# EAGLE design MMA7660FCv1.0 (EAGLE 5.10)
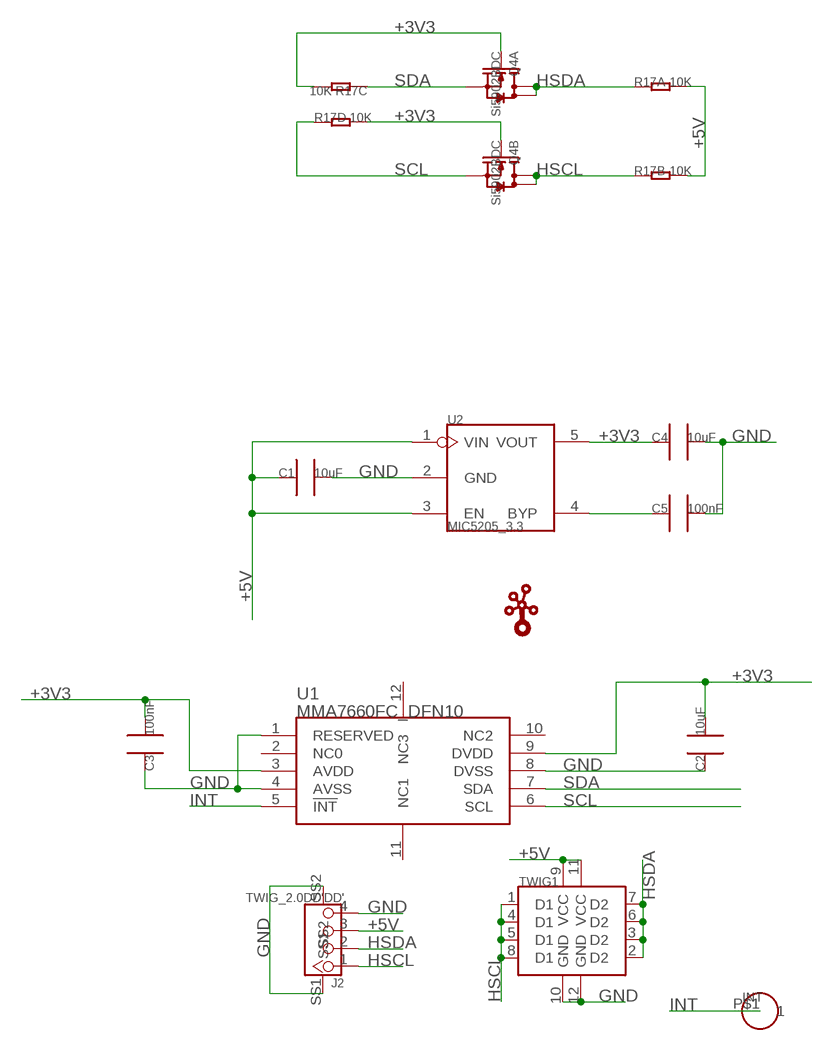
[diagram p0: schematic, sheet 1]

## Parts
C1  10uF  C0805_S  [0805_S]
C2  10uF  C0805_S  [0805_S]
C3  100nF  C0603_S  [0603_S]
C4  10uF  C0805_S  [0805_S]
C5  100nF  C0603_S  [0603_S]
INT  CK_1X132  [CK_1X1]
J2  TWIG_2.0DD'DD'  [2.0_1X4DD]
Q4  Si5902BDC  010-DUAL-N-MOSFET_1206-8  [1206-8]
R17  10K  005-4R_1206  [R1206-8]
TWIG1  TWIG-U1'HOLES'  [U1_HOLES]
U1  MMA7660FC_DFN10  [DFN10]
U2  MIC5205_3.3  MIC5025_X.X  [SOT23-5]
U$1  TWIGLOGOTWIGLOGO_SMALL  [TWIGLOGO_SMALL]

## Nets
+3V3: C2.2 C3.2 C4.1 Q4.2(A:G) Q4.4(B:G) R17.5 R17.6 U1.3(AVDD) U1.9(DVDD) U2.5(VOUT)
+5V: C1.1 J2.3 R17.7 R17.8 TWIG1.9(VCC) TWIG1.11(VCC) U2.1(VIN) U2.3(EN)
GND: C1.2 C2.1 C3.1 C4.2 C5.2 J2.4 J2.SS1 J2.SS2 TWIG1.10(GND) TWIG1.12(GND) U1.1(RESERVED) U1.4(AVSS) U1.8(DVSS) U2.2(GND)
HSCL: J2.1 Q4.5(B:D) Q4.6(B:D) R17.2 TWIG1.1(D1) TWIG1.4(D1) TWIG1.5(D1) TWIG1.8(D1)
HSDA: J2.2 Q4.7(A:D) Q4.8(A:D) R17.1 TWIG1.2(D2) TWIG1.3(D2) TWIG1.6(D2) TWIG1.7(D2)
INT: INT.P$1 U1.5(!INT)
N$3: C5.1 U2.4(BYP)
SCL: Q4.3(B:S) R17.4 U1.6(SCL)
SDA: Q4.1(A:S) R17.3 U1.7(SDA)
Unconnected: U1.2(NC0) U1.10(NC2) U1.11(NC1) U1.12(NC3)

## Library data of the parts
C1 C2 C4 = CPT_SMD:C0805
C3 C5 = CPT_SMD:C0603
INT = CONNECTER1:CK_1X1
J2 = CONNECTER:TWIG_2.0DD
Q4 = Discrete:010-DUAL-N-MOSFET*: Si5902BDC Si5904DC Si5908DC Si5920DC
R17 = Discrete:005-4R*: Resistor Array
TWIG1 = twig_template1:TWIG-U1
U1 = ICs_v54:MMA7660FC
U2 = ICs_v54:MIC5025_X.X
U$1 = seeedleo:TWIGLOGO

## Net classes
0 default: width 0.203 mm, drill 0.305 mm, clearance 0.203 mm

## Board
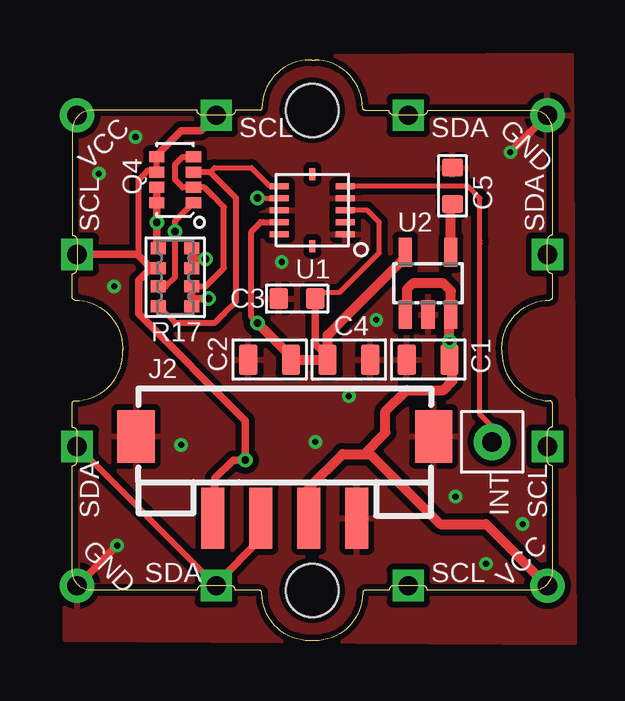
[diagram p1: board, top side]
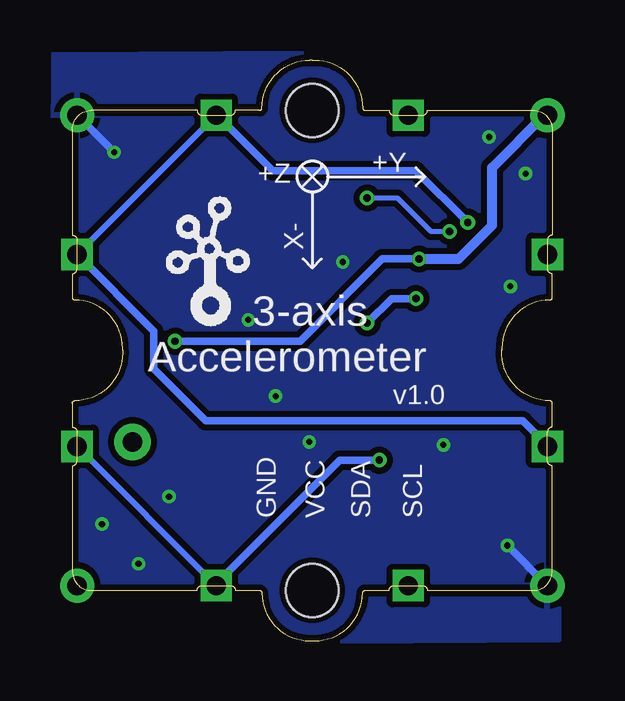
[diagram p2: board, bottom side, seen from below]

Size 20 x 24.2 mm. Coordinates in mm from the lower left corner, seen from the top.
Copper layers (1*16): Top 0.035mm / dielectric 1.5mm / Bottom 0.035mm
Design rules "SeeedStudio_rule_no_angle_090911": minimum track width 6mil, minimum drill 12mil, track to track 6mil, track to pad 6mil, pad to pad 6mil, via to via 6mil, smd to smd 0mil, copper to edge 10mil, drill to drill 10mil, minimum pad ring 10mil, minimum via ring 6mil, stop-mask expansion 2mil, vias tented up to drill 100mil, thermal gap 10mil

### Footprints (pad centres in the part's own frame; a part is rotated, then mirrored left to right if it is on the bottom)
0805_S = smd 0.762 x 1.27: 1 -0.889,0; 2 0.889,0
0603_S = smd 0.762 x 0.889: 1 -0.762,0; 2 0.762,0
CK_1X1 = drill 0.813 pad 1.524 round: P$1 0,0
2.0_1X4DD = smd 0.965 x 2.54: 1 -3,0; 2 -1,0; 3 1,0; 4 3,0 | smd 1.55 x 2.184: SS1 -6.2,3.4; SS2 6.2,3.4
1206-8 = smd 0.457 x 0.635: 1 -0.953,-0.762; 2 -0.318,-0.762; 3 0.318,-0.762; 4 0.953,-0.762; 5 0.953,0.762; 6 0.318,0.762; 7 -0.318,0.762; 8 -0.953,0.762
R1206-8 = smd 0.508 x 0.635: 1 -1.206,-0.699; 2 -0.381,-0.699; 3 0.381,-0.699; 4 1.206,-0.699; 5 1.206,0.699; 6 0.381,0.699; 7 -0.381,0.699; 8 -1.206,0.699
U1_HOLES = drill 0.8 pad 1.27 square: 1 -4,9.8; 2 4,9.8; 3 9.8,4; 4 9.8,-4; 5 4,-9.8; 6 -4,-9.8; 7 -9.8,-4; 8 -9.8,4 | drill 0.8 pad 1.422 round: 9 -9.8,9.8; 10 9.8,9.8; 11 9.8,-9.8; 12 -9.8,-9.8 | hole 2.2: 0,-10; 0,10
DFN10 = smd 0.8 x 0.25: 1 -1.375,1; 2 -1.375,0.5; 3 -1.375,0; 4 -1.375,-0.5; 5 -1.375,-1; 6 1.375,-1; 7 1.375,-0.5; 8 1.375,0; 9 1.375,0.5; 10 1.375,1 | smd 0.25 x 0.5: 11 0,-1.5; 12 0,1.5
SOT23-5 = smd 0.55 x 1.2: 1 -0.95,-1.3; 2 0,-1.3; 3 0.95,-1.3; 4 0.95,1.3; 5 -0.95,1.3

### Placement (x,y rotation side)
C1  14.83,11.72 180 top
C2  8.22,11.72 0 top
C3  9.37,14.26 0 top
C4  11.52,11.72 0 top
C5  15.84,18.96 90 top
INT  17.49,8.29 90 top
J2  8.86,5.11 0 top
Q4  4.29,19.21 90 top
R17  4.29,15.15 270 top
TWIG1  10,12.1 180 top
U1  10,17.94 180 top
U2  14.83,14.89 0 top
U$1  16.48,12.99 0 bottom

### Tracks (layer width: path | path; a pad name or v marks a point on that pad's centre or on a via)
+3V3  (via drill 0.3)
  Top 0.203: U1.3 12.29,17.94 12.79,17.43 12.79,16.16 11.14,14.51 10.38,14.51 C3.2
  Top 0.254: Q4.4 4.6,20.16 4.29,19.85 4.29,19.21 4.6,18.89 Q4.2 5.49,18.89 5.81,18.58 6.32,18.07 6.32,15.53 5.81,15.02 5.56,14.77 R17.6 | U1.9 7.98,17.44 7.85,17.44 7.46,17.05 7.46,13.5 v7.71,13.24 | v7.71,13.24 7.84,13.12 v7.71,13.24
  Top 0.305: R17.6 4.98,14.26 | 4.98,14.26 R17.5 | 4.98,14.26 v5.68,14.26 | C3.2 10.13,12.35 10.63,11.85
  Top 0.406: U2.5 13.88,15.98 11.4,13.5 10.63,12.73 10.63,11.85 C4.1 C2.2 9.11,11.85 v7.71,13.24
  Bottom 0.305: v5.68,14.26 5.94,14.26 6.7,14.26 v7.71,13.24
+5V  (via drill 0.3)
  Top 0.254: R17.7 4.98,15.85 5.05,15.91
  Top 0.305: R17.7 R17.8 | v5.56,15.91 5.05,15.91 | C1.1 v15.72,12.48
  Top 0.406: 13.94,13.53 U2.1 13.94,13.65 13.94,14.64 14.19,14.89 15.46,14.89 15.78,14.58 U2.3 15.72,13.53 v15.72,12.48 C1.1 15.84,11.59 15.84,10.83 15.46,10.45 13.94,10.45 13.05,9.56 13.05,8.67 12.16,7.78 | J2.3 9.86,6.37 11.27,7.78 12.16,7.78 | TWIG1.9 17.24,4.86 15.33,4.86 12.54,7.65 12.41,7.78 12.16,7.78
  Bottom 0.305: v15.72,12.48 10.51,12.48 7.08,15.91 v5.56,15.91
  Bottom 0.406: TWIG1.11 0.33,21.9 2.51,19.72 2.51,17.31 3.9,15.91 v5.56,15.91
GND  (via drill 0.25)
  Top 0.305: TWIG1.12 v18.26,20.35 | TWIG1.10 v1.87,3.97
  Bottom 0.305: TWIG1.12 v18.26,20.35 | TWIG1.10 v1.87,3.97
  other vias: 11.52,10.2 1.11,19.47 8.73,15.78 2.63,20.99 18.76,4.86 17.24,3.21 10.13,8.29 15.97,6 12.67,13.37 1.75,14.77 4.54,8.16
  pour Top (isolate 0.254): -0.29,0.03 -0.41,24.29 20.8,24.42 20.92,-0.09
  pour Bottom (isolate 0.254): -0.29,0.03 -0.41,24.55 20.8,24.42 20.92,-0.09
HSCL  (via drill 0.3)
  Top 0.254: 3.27,15.53 R17.2 | 2.76,16.04 2.76,19.21 3.14,19.59 3.46,19.59 | Q4.6 Q4.5
  Top 0.305: 3.46,19.59 Q4.6 | TWIG1.4 2.7,16.1 2.76,16.04 2.89,15.91 3.27,15.53 2.76,15.02 2.76,13.62 7.21,9.18 7.21,9.09 v7.21,7.53 6.7,7.53 5.94,6.77 5.94,5.07 J2.1 | Q4.5 3.52,20.23 4.54,21.24 5.34,21.24 TWIG1.5
  Bottom 0.254: TWIG1.1 TWIG1.8
  Bottom 0.305: TWIG1.1 14,2.38 8.86,7.53 v7.21,7.53
HSDA  (via drill 0.3)
  Top 0.254: TWIG1.2 TWIG1.3
  Top 0.305: Q4.8 Q4.7 | v3.52,17.43 3.52,16.42 R17.1 | v3.52,17.43 Q4.8 | v3.52,17.43 Q4.8 | TWIG1.2 6,2.38 7.84,4.23 7.84,4.97 J2.2
  Bottom 0.254: TWIG1.7 TWIG1.6
  Bottom 0.305: TWIG1.6 13.96,21.9 11.65,19.59 5.68,19.59 v3.52,17.43 | TWIG1.3 0.2,8.14 1.24,9.18 14.45,9.18 16.6,11.34 16.6,12.9 TWIG1.7
INT
  Top 0.203: INT.P$1 17.49,8.92 16.98,9.43 16.98,16.55 | 16.98,16.55 16.98,16.67 | U1.5 16.49,18.94 16.98,18.45 16.98,16.55
N$3
  Top 0.406: U2.4 15.78,18.13 C5.1
SCL
  Top 0.203: 6.33,18.94 6.32,18.96 | U1.6 8.24,18.94 7.59,19.59 7.46,19.72 5.94,19.72 5.75,19.53
  Top 0.254: Q4.3 5.75,19.53 6.32,18.96 | R17.4 4.29,13.24 5.94,13.24 6.06,13.37 6.32,13.62 6.83,14.13 6.83,18.45 6.33,18.94
SDA  (via drill 0.3)
  Top 0.203: U1.7 v7.72,18.44 v7.71,18.45
  Top 0.254: R17.3 3.9,14.77 4.29,15.15 v4.29,17.05 4.29,17.5 Q4.1
  Bottom 0.203: v7.71,18.45 6.44,18.45 5.05,17.05 v4.29,17.05

### Text on the board
tPlace: VCC | SCL | SDA | GND | SCL | SDA | SDA | VCC | SCL | GND | SDA | SCL
bPlace: +Y | +Z | X- | 3-axis | Accelerometer | v1.0 | SCL | SDA | VCC | GND